# EAGLE design transistortester (EAGLE 5.05)
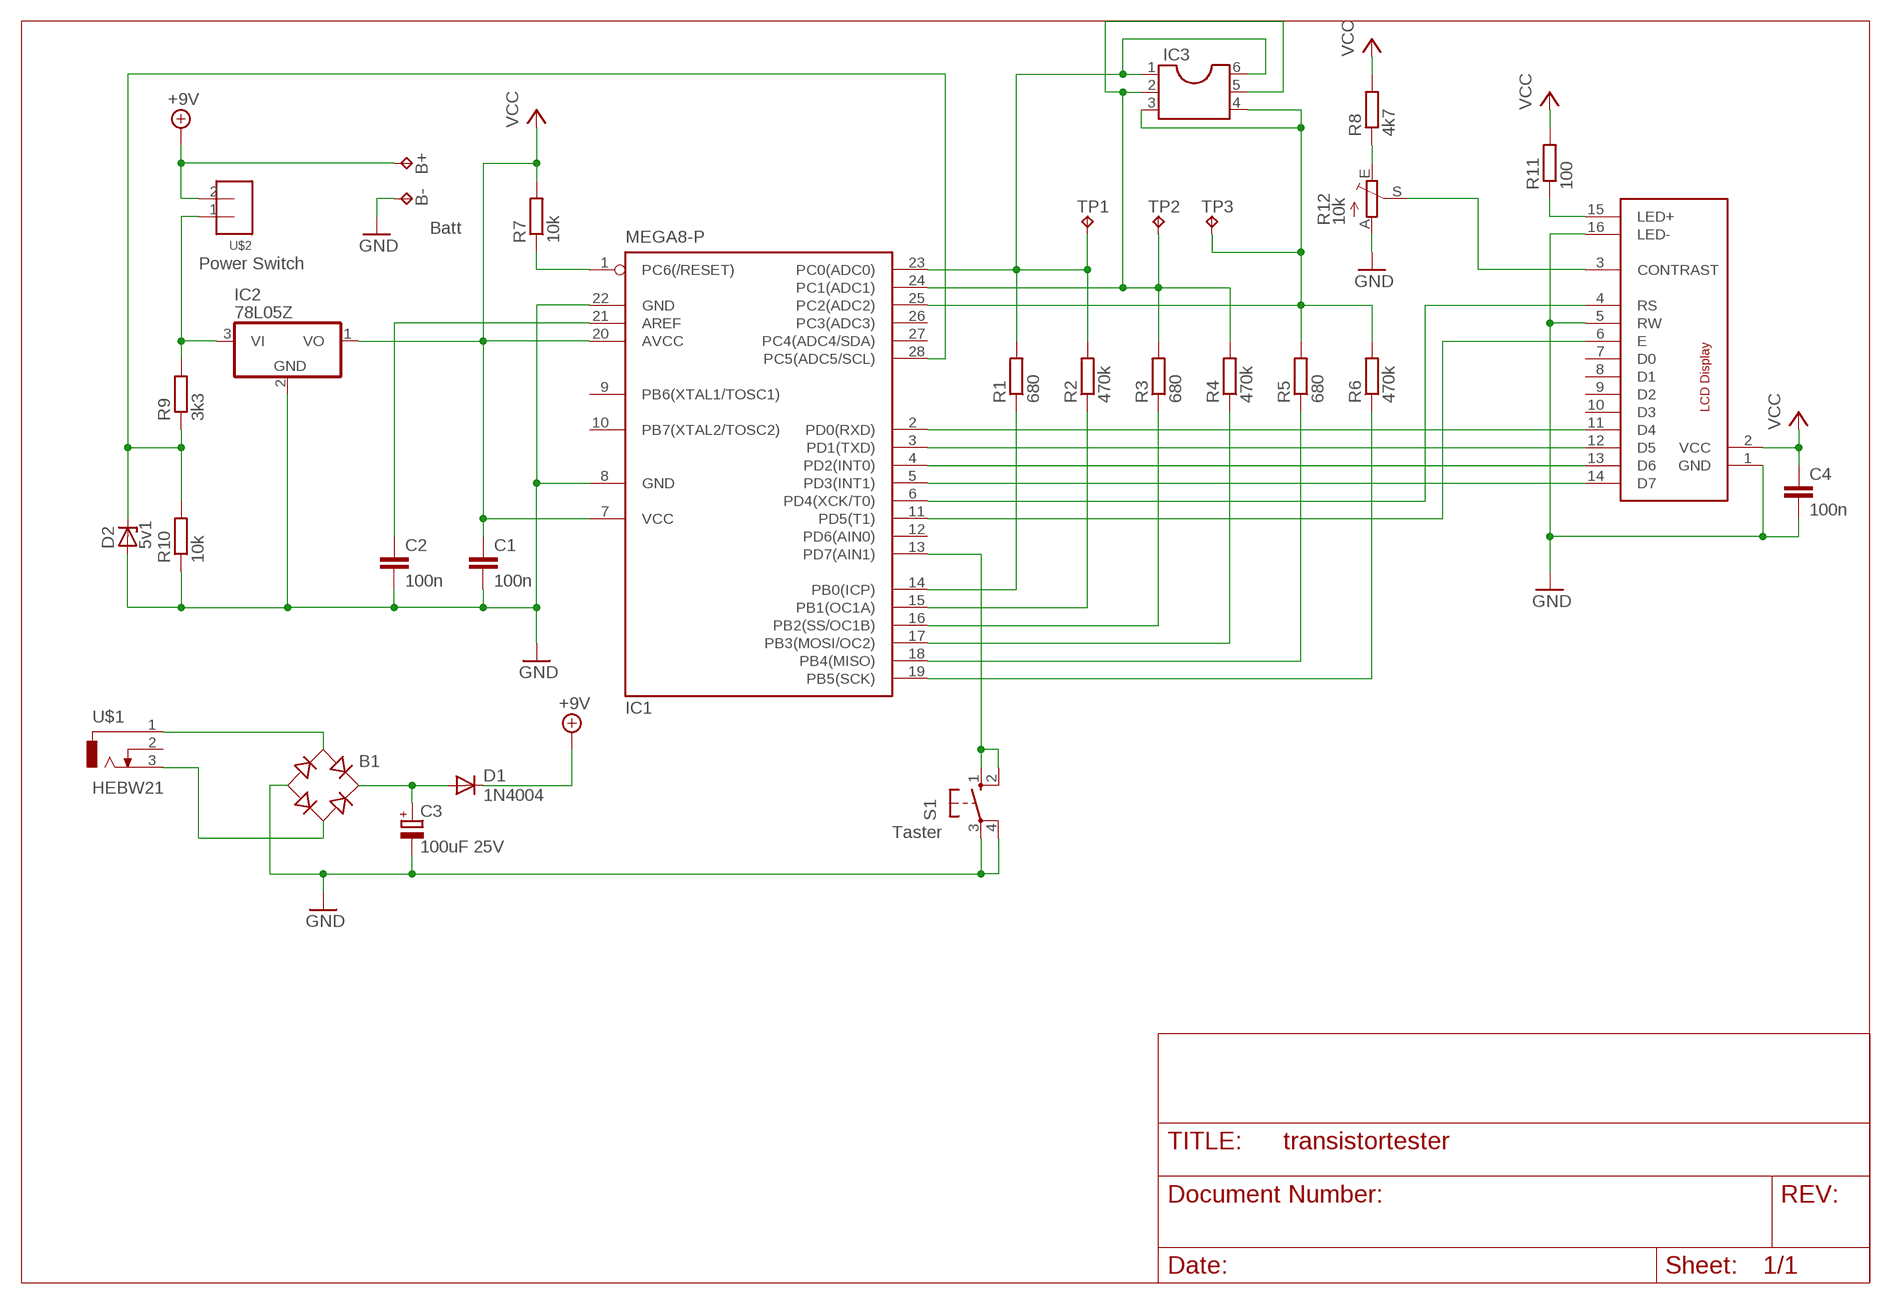
[diagram p0: schematic, sheet 1]

## Parts
B1  B-DIL  [B-DIL]
B+  TPPAD1-13Y  [P1-13Y]
B-  TPPAD1-13Y  [P1-13Y]
C1  100n  C-EUC0805K  [C0805K]
C2  100n  C-EUC0805K  [C0805K]
C3  100uF 25V  CPOL-EUE3.5-8  [E3,5-8]
C4  100n  C-EUC0805K  [C0805K]
D1  1N4004  [DO41-10]
D2  5v1  ZPD  [DO35Z10]
IC1  MEGA8-P  [DIL28-3]
IC2  78L05Z  [TO92]
IC3  DIL6S  [SOCKET-06]
LCD1  DISPLAYTECH-162JUMPER2ROWS  [PFOSTENSTECKER-16]
R1  680  R-EU_0204/7  [0204/7@1]
R2  470k  R-EU_0204/7  [0204/7@1]
R3  680  R-EU_0204/7  [0204/7@1]
R4  470k  R-EU_0204/7  [0204/7@1]
R5  680  R-EU_0204/7  [0204/7@1]
R6  470k  R-EU_0204/7  [0204/7@1]
R7  10k  R-EU_0204/7  [0204/7@1]
R8  4k7  R-EU_0204/7  [0204/7@1]
R9  3k3  R-EU_0204/7  [0204/7@1]
R10  10k  R-EU_0204/7  [0204/7@1]
R11  100  R-EU_0204/7  [0204/7@1]
R12  10k  TRIM_EU-RS3  [RS3]
S1  10-XX  [B3F-10XX]
TP1  TPPAD1-13Y  [P1-13Y]
TP2  TPPAD1-13Y  [P1-13Y]
TP3  TPPAD1-13Y  [P1-13Y]
U$1  HEBW21  [P_HEBW21]
U$2  PS25/2G  [PS25-2G]

## Nets
+9V: B+.1(TP) D1.C U$2.2
E: IC1.11(PD5(T1)) LCD1.6(E)
GND: B1.- B-.1(TP) C1.2 C2.2 C3.- C4.2 D2.A IC1.8(GND) IC1.22(GND) IC2.2(GND) LCD1.1(GND) LCD1.5(RW) LCD1.16(LED-) R10.1 R12.A S1.3(P) S1.4(P1)
N$1: IC1.14(PB0(ICP)) R1.1
N$2: IC1.15(PB1(OC1A)) R2.1
N$3: IC1.16(PB2(SS/OC1B)) R3.1
N$4: IC1.17(PB3(MOSI/OC2)) R4.1
N$5: IC1.18(PB4(MISO)) R5.1
N$6: IC1.19(PB5(SCK)) R6.1
N$7: IC1.1(PC6(/RESET)) R7.1
N$8: IC1.23(PC0(ADC0)) IC3.1 IC3.6 R1.2 R2.2 TP1.1(TP)
N$9: IC1.24(PC1(ADC1)) IC3.2 IC3.5 R3.2 R4.2 TP2.1(TP)
N$10: IC1.25(PC2(ADC2)) IC3.3 IC3.4 R5.2 R6.2 TP3.1(TP)
N$11: IC1.5(PD3(INT1)) LCD1.14(D7)
N$12: IC1.4(PD2(INT0)) LCD1.13(D6)
N$13: IC1.3(PD1(TXD)) LCD1.12(D5)
N$14: IC1.2(PD0(RXD)) LCD1.11(D4)
N$17: B1.AC1 U$1.1
N$18: R8.1 R12.E
N$19: LCD1.3(CONTRAST) R12.S
N$20: C2.1 IC1.21(AREF)
N$21: D2.C IC1.28(PC5(ADC5/SCL)) R9.1 R10.2
N$22: IC2.3(VI) R9.2 U$2.1
N$23: B1.AC2 U$1.3
N$24: B1.+ C3.+ D1.A
N$27: IC1.13(PD7(AIN1)) S1.1(S) S1.2(S1)
N$28: LCD1.15(LED+) R11.1
RS: IC1.6(PD4(XCK/T0)) LCD1.4(RS)
VCC: C1.1 C4.1 IC1.7(VCC) IC1.20(AVCC) IC2.1(VO) LCD1.2(VCC) R7.2 R8.2 R11.2
Unconnected: IC1.9(PB6(XTAL1/TOSC1)) IC1.10(PB7(XTAL2/TOSC2)) IC1.12(PD6(AIN0)) IC1.26(PC3(ADC3)) IC1.27(PC4(ADC4/SDA)) LCD1.7(D0) LCD1.8(D1) LCD1.9(D2) LCD1.10(D3) U$1.2

## Notes on the sheet
- Batt
- Power Switch
- Taster

## Library data of the parts
B1 = rectifier:B-DIL: RECTIFIER
B+ B- TP1-TP3 = testpad:TP: Test pad
C1 C2 C4 = rcl:C-EU: CAPACITOR, European symbol
C3 = rcl:CPOL-EU: POLARIZED CAPACITOR, European symbol
D1 = diode:1N4004: DIODE general purpose rectifier, 1 A
D2 = diode:ZPD: Z DIODE 500 mW
IC1 = atmel:MEGA8-P: MICROCONTROLLER 8 Kbytes FLASH, 1 kbytes SRAM, 512 bytes EEPROM, USART, 4-channel 10 bit ADC, 2-channel 8 bit ADC Pin compatible with Atmega48, ATMega88, ATMega168 Source: avr.lbr
IC2 = linear:78*: Positive VOLTAGE REGULATOR Source: http://cache.national.com/ds/LM/LM78L05.pdf http://www.fairchildsemi.com/ds/LM/LM7805.pdf
IC3 = ic-package:DIL6: Dual In Line / Socket
LCD1 = ad:DISPLAYTECH-162: Displaytech 162 Reichelt LCD 162C LED or LCD 162C-BL HD44780 compatible LCD Display 2x16 Chars with LED backlight
R1-R11 = rcl:R-EU_: RESISTOR, European symbol
R12 = pot:TRIM_EU-: POTENTIOMETER
S1 = switch-omron:10-XX: OMRON SWITCH
U$1 = ad:HEBW21: Reichelt Hohlsteckerbuchse HEBW 21 oder HEBW 25
U$2 = ad:PS25/2G: Reichelt PS 25/2G 2 Pin Connector with Cable, Raster 2,54mm

## Board
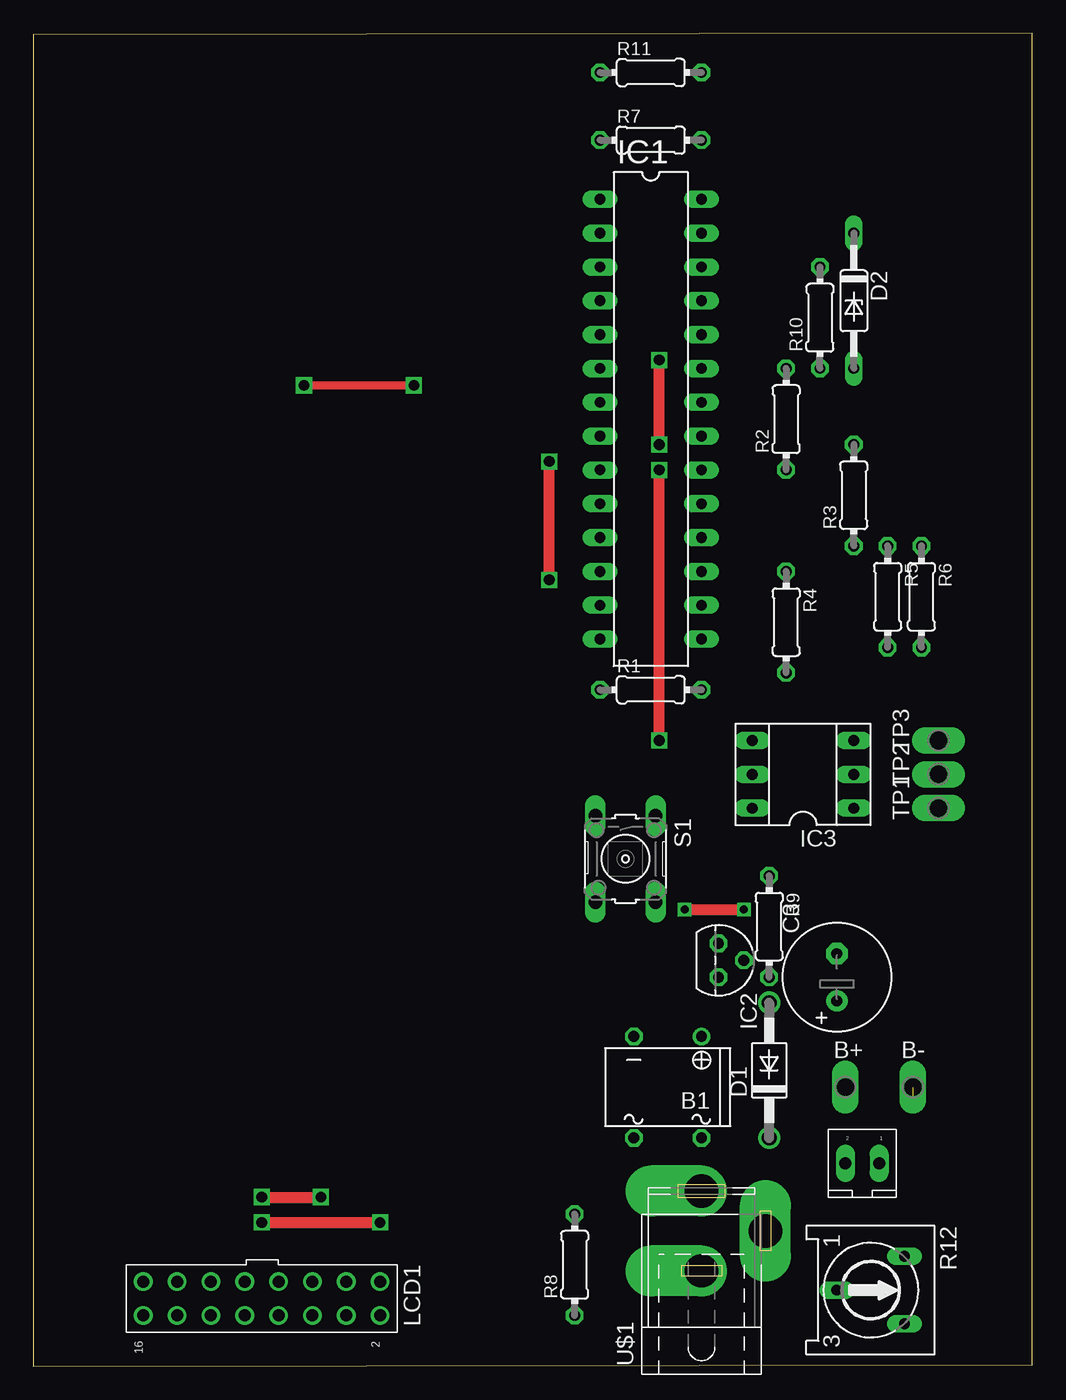
[diagram p1: board, top side]
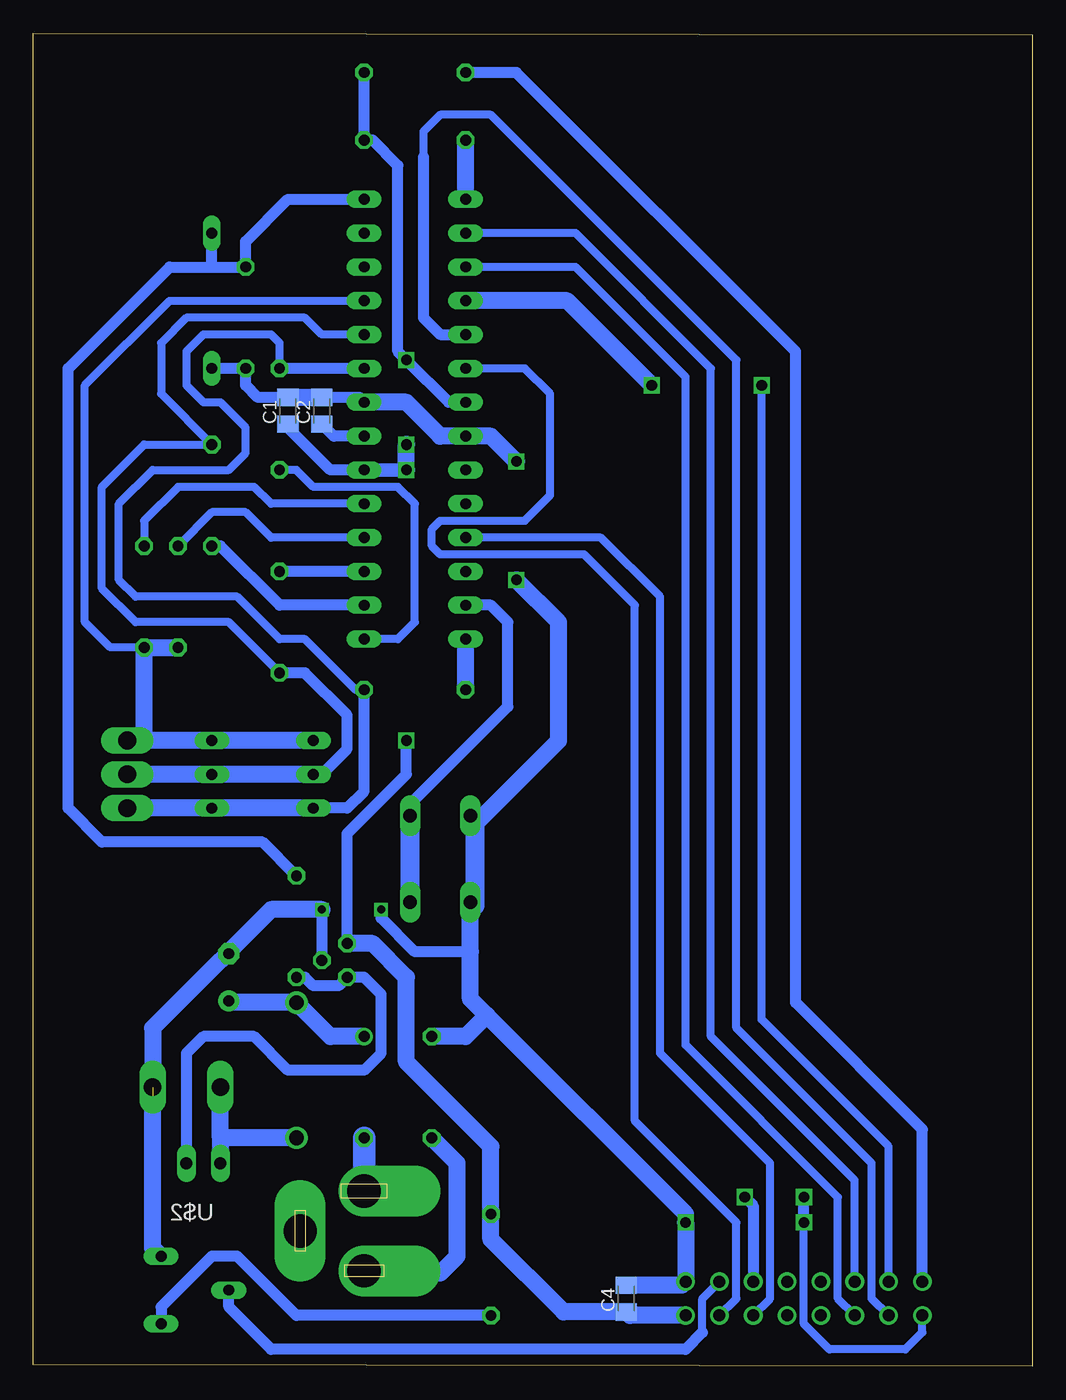
[diagram p2: board, bottom side, seen from below]

Size 75 x 100.1 mm. Coordinates in mm from the lower left corner, seen from the top.
Outline: 0,0 75,0.1 75,100.1 0,100 0,0
Copper layers (1*16): Top 0.035mm / dielectric 1.5mm / Bottom 0.035mm
Design rules "default": minimum track width 10mil, minimum drill 24mil, track to track 8mil, track to pad 8mil, pad to pad 8mil, via to via 8mil, smd to smd 8mil, copper to edge 40mil, drill to drill 8mil, minimum pad ring 10mil, minimum via ring 8mil, stop-mask expansion 4mil, vias tented up to drill 0mil, thermal gap 10mil

### Footprints (pad centres in the part's own frame; a part is rotated, then mirrored left to right if it is on the bottom)
B-DIL = drill 0.813 round: + -2.54,-3.81 | drill 0.813 octagon: - 2.54,-3.81; AC1 2.54,3.81; AC2 -2.54,3.81
P1-13Y = drill 1.321 pad 1.905 long: 1 0,0
C0805K = smd 1.3 x 1.6: 1 -1,0; 2 1,0
E3,5-8 = drill 0.813 pad 1.6 round: + -1.778,0 | drill 0.813 pad 1.6 octagon: - 1.778,0
DO41-10 = drill 1.118 round: A 5.08,0; C -5.08,0
DO35Z10 = drill 0.813 long: A 5.08,0; C -5.08,0
DIL28-3 = drill 0.813 long: 1 -16.51,-3.81; 2 -13.97,-3.81; 3 -11.43,-3.81; 4 -8.89,-3.81; 5 -6.35,-3.81; 6 -3.81,-3.81; 7 -1.27,-3.81; 8 1.27,-3.81; 9 3.81,-3.81; 10 6.35,-3.81; 11 8.89,-3.81; 12 11.43,-3.81; 13 13.97,-3.81; 14 16.51,-3.81; 15 16.51,3.81; 16 13.97,3.81; 17 11.43,3.81; 18 8.89,3.81; 19 6.35,3.81; 20 3.81,3.81; 21 1.27,3.81; 22 -1.27,3.81; 23 -3.81,3.81; 24 -6.35,3.81; 25 -8.89,3.81; 26 -11.43,3.81; 27 -13.97,3.81; 28 -16.51,3.81
TO92 = drill 0.813 octagon: 1 -1.27,0; 2 0,1.905; 3 1.27,0
SOCKET-06 = drill 0.813 long: 1 -2.54,-3.81; 2 0,-3.81; 3 2.54,-3.81; 4 2.54,3.81; 5 0,3.81; 6 -2.54,3.81
PFOSTENSTECKER-16 = drill 0.9 round: 1 -1.27,8.89; 2 1.27,8.89; 3 -1.27,6.35; 4 1.27,6.35; 5 -1.27,3.81; 6 1.27,3.81; 7 -1.27,1.27; 8 1.27,1.27; 9 -1.27,-1.27; 10 1.27,-1.27; 11 -1.27,-3.81; 12 1.27,-3.81; 13 -1.27,-6.35; 14 1.27,-6.35; 15 -1.27,-8.89; 16 1.27,-8.89
0204/7@1 = drill 0.813 octagon: 1 -3.81,0; 2 3.81,0
RS3 = drill 0.813 long: A -2.54,2.54; E 2.54,2.54; S 0,-2.54
B3F-10XX = drill 1.016 long: 1 -3.251,2.261; 2 3.251,2.261; 3 -3.251,-2.261; 4 3.251,-2.261
P_HEBW21 = drill 2.5 pad 3.81 offset: 1 -3,0; 3 3,0 | drill 2.5 pad 3.81 long: 2 0,-4.8
PS25-2G = drill 0.9 long: 1 -2.54,0; 2 0,0

### Placement (x,y rotation side)
B1  47.62,20.95 180 top
B+  60.96,20.95 0 top
B-  66.04,20.95 0 top
C1  55.88,71.75 90 bottom
C2  53.34,71.75 90 bottom
C3  60.33,29.21 90 top
C4  30.48,5.08 90 bottom
D1  55.24,22.23 90 top
D2  61.59,80.01 270 top
IC1  46.35,71.12 270 top
IC2  51.44,30.48 270 top
IC3  57.78,44.45 90 top
LCD1  17.14,5.08 270 top
R1  46.35,50.8 0 top
R2  56.52,71.12 90 top
R3  61.59,65.41 90 top
R4  56.52,55.88 270 top
R5  64.14,57.78 270 top
R6  66.67,57.78 270 top
R7  46.35,92.08 0 top
R8  40.64,7.62 90 top
R9  55.24,33.02 270 top
R10  59.05,78.74 90 top
R11  46.35,97.16 0 top
R12  62.87,5.71 270 top
S1  44.45,38.1 270 top
TP1  67.94,41.91 90 top
TP2  67.94,44.45 90 top
TP3  67.94,46.99 90 top
U$1  50.16,10.16 90 top
U$2  60.96,15.24 180 top

### Tracks (layer width: path | path; a pad name or v marks a point on that pad's centre or on a via)
+9V
  Bottom 1.27: 60.96,17.14 U$2.2 | 60.96,17.14 B+.1 | D1.C 60.96,17.14
E
  Bottom 0.61: LCD1.6 19.68,5.08 19.68,15.24 27.94,23.5 27.94,57.78 32.38,62.23 IC1.11
GND  (via drill 0.6, 0.8)  (1 unrouted)
  Top 0.813: v38.73,59.05 v38.73,67.94 | v17.14,10.79 v26.04,10.79 | v17.14,12.7 v21.59,12.7 | v48.9,34.29 v53.34,34.29
  Bottom 0.61: LCD1.16 8.26,2.54 9.53,1.27 15.24,1.27 17.14,3.17 v17.14,10.79
  Bottom 0.813: C2.2 50.53,72.75 IC1.22 | C1.2 58.15,72.75 59.05,73.66 R10.1 D2.A | v26.04,10.79 26.04,11.43 | v21.59,12.7 20.95,12.06 LCD1.5 | v17.14,10.79 v17.14,12.7 | v53.34,34.29 IC2.2 | v48.9,34.29 48.9,33.66 46.35,31.11 42.19,31.11
  Bottom 1.27: IC1.22 46.99,72.39 44.45,69.85 IC1.8 40.64,69.85 v38.73,67.94 | C2.2 C1.2 | S1.3 41.83,40.72 35.56,46.99 35.56,55.88 v38.73,59.05 | 41.83,34.57 S1.4 42.19,31.11 42.19,27.58 40.96,26.35 | 26.04,11.43 40.96,26.35 | B1.- 42.55,24.77 40.96,26.35 | B-.1 66.04,25.4 61.09,30.35 C3.- 60.33,31.11 57.15,34.29 v53.34,34.29 | R12.A 66.04,8.89 66.04,20.32 | v26.04,10.79 LCD1.1 26.3,6.08 C4.2
  Bottom 1.422: 41.83,34.57 41.83,40.72
N$1
  Bottom 1.27: R1.1 IC1.14
N$2
  Bottom 0.61: R2.1 55.24,67.31 53.98,66.04 47.62,66.04 46.35,64.77 46.35,55.88 47.62,54.61 IC1.15
N$3
  Bottom 0.813: IC1.16 56.52,57.15 60.96,61.59 R3.1
N$4
  Bottom 0.813: IC1.17 R4.1
N$5
  Bottom 0.61: IC1.18 57.15,62.23 59.05,64.14 61.59,64.14 R5.1
N$6
  Bottom 0.61: IC1.19 57.15,64.77 58.42,66.04 64.14,66.04 66.67,63.5 R6.1
N$7
  Bottom 1.27: IC1.1 R7.1
N$8
  Bottom 0.61: R1.2 50.8,50.8 54.61,54.61 56.52,54.61 59.69,57.78 67.31,57.78 68.58,59.05 68.58,64.77 66.04,67.31 60.33,67.31 59.05,68.58 59.05,70.48 60.96,72.39 62.23,72.39 63.5,73.66 63.5,76.2 62.23,77.47 57.15,77.47 56.52,76.83 R2.2
  Bottom 0.813: IC1.23 R2.2 | R1.2 50.16,43.18 51.44,41.91 IC3.6
  Bottom 1.27: IC3.6 IC3.1 TP1.1
N$9
  Bottom 0.61: IC1.24 53.34,77.47 54.61,78.74 63.5,78.74 65.41,76.83 65.41,73.03 R3.2 66.67,69.22 69.85,66.04 69.85,58.42 67.31,55.88 60.33,55.88 R4.2
  Bottom 0.813: R4.2 54.61,52.07 51.44,48.9 51.44,46.35 53.34,44.45 IC3.5
  Bottom 1.27: IC3.5 IC3.2 TP2.1
N$10
  Bottom 0.61: IC1.25 64.77,80.01 71.12,73.66 71.12,55.88 69.22,53.98 R6.2
  Bottom 1.27: R5.2 R6.2 66.67,46.99 | IC3.4 IC3.3 66.67,46.99 | 66.67,46.99 TP3.1
N$11
  Bottom 0.61: LCD1.14 12.06,5.08 12.06,15.24 22.23,25.4 22.23,75.56 40.64,93.98 44.45,93.98 45.72,92.71 45.72,90.81
  Bottom 0.813: 45.72,90.81 45.72,78.74 44.45,77.47 IC1.5
N$12  (via drill 0.8)
  Top 0.61: v20.32,73.66 v28.57,73.66
  Bottom 0.61: LCD1.13 10.79,16.51 20.32,26.04 v20.32,73.66
  Bottom 1.27: IC1.4 34.92,80.01 v28.57,73.66
N$13
  Bottom 0.61: LCD1.12 14.61,5.08 14.61,12.7 26.04,24.13 26.04,74.3 34.29,82.55 IC1.3
N$14
  Bottom 0.61: LCD1.11 13.34,13.97 24.13,24.77 24.13,74.93 34.29,85.09 IC1.2
N$17
  Bottom 0.813: 49.99,6.99 U$1.1
  Bottom 1.27: B1.AC1 43.18,15.24 43.18,8.26 44.45,6.99 49.99,6.99
N$18
  Bottom 0.813: R8.1 55.24,3.81 59.69,8.26 61.59,8.26 65.41,4.45 R12.E
N$19
  Bottom 0.61: 24.77,2.54 24.77,5.08 LCD1.3
  Bottom 0.813: 24.77,2.54 26.04,1.27 57.15,1.27 60.33,4.45 R12.S
N$20
  Bottom 0.813: IC1.21 52.44,69.85 C2.1
N$21
  Bottom 0.813: IC1.28 55.88,87.63 59.05,84.45 R10.2 61.59,82.55 | 61.59,82.55 64.77,82.55 72.39,74.93 72.39,41.91 69.85,39.37 57.78,39.37 R9.1 | 61.59,82.55 D2.C
N$22
  Bottom 0.813: R9.2 54.61,29.21 53.98,28.57 52.07,28.57 IC2.3 50.16,29.21 48.9,27.94 48.9,23.5 50.16,22.23 55.88,22.23 58.42,24.77 62.23,24.77 63.5,23.5 U$2.1
N$23
  Bottom 1.676: U$1.3 B1.AC2
N$24
  Bottom 0.813: 60.2,27.3 C3.+
  Bottom 1.27: B1.+ 52.7,24.77 D1.A 60.2,27.3
N$27
  Bottom 0.61: 46.99,41.91 46.99,41 S1.1
  Bottom 0.813: IC1.13 40.64,57.15 39.37,55.88 39.37,49.53 46.99,41.91
  Bottom 1.422: S1.2 S1.1
N$28
  Bottom 0.813: LCD1.15 8.26,17.78 17.78,27.3 17.78,76.2 38.73,97.16 R11.1
RS
  Bottom 0.61: LCD1.4 22.23,5.08 22.23,10.79 29.84,18.41 29.84,57.15 33.66,60.96 44.45,60.96 45.09,61.59 45.09,62.87 44.45,63.5 38.1,63.5 36.2,65.41 36.2,73.03 38.1,74.93 IC1.6
VCC  (via drill 0.8)
  Top 0.813: v46.99,69.22 v46.99,75.56 | v46.99,46.99 v46.99,67.31
  Bottom 0.813: IC1.7 43.81,72.39 v46.99,75.56 47.62,76.2 47.62,90.17 49.53,92.08 R7.2 R11.2 | C1.1 55.88,70.48 52.7,67.31 IC1.20 | v46.99,67.31 v46.99,69.22 | IC2.1 51.44,40.01 46.99,44.45 v46.99,46.99
  Bottom 1.016: v46.99,67.31 IC1.20
  Bottom 1.27: v46.99,67.31 v46.99,69.22 | IC2.1 49.53,31.75 46.99,29.21 46.99,22.86 40.64,16.51 R8.2 | R8.2 40.64,11.7 | LCD1.2 30.21,3.81 C4.1 35.2,4.08 40.64,9.53 R8.2